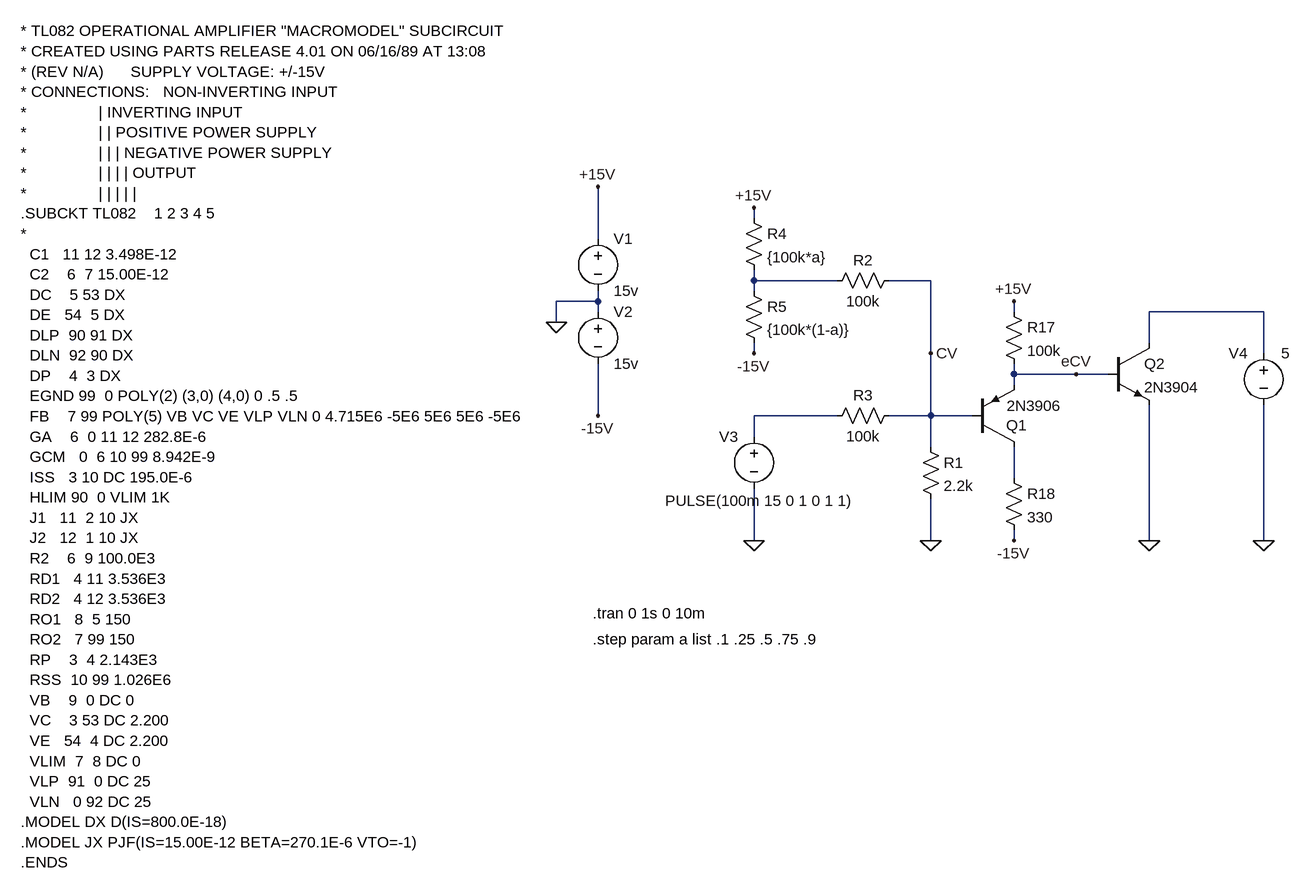
[diagram p0: schematic CV2exp2.asc]
CV2exp2.asc, the LTspice schematic file:
Version 4
SHEET 1 2688 2848
WIRE -544 32 -544 16
WIRE -784 64 -784 -16
WIRE -544 128 -544 112
WIRE -416 128 -544 128
WIRE -272 128 -336 128
WIRE -544 144 -544 128
WIRE -784 160 -784 144
WIRE -784 160 -848 160
WIRE -784 176 -784 160
WIRE -144 176 -144 160
WIRE 240 176 64 176
WIRE -848 192 -848 160
WIRE 64 224 64 176
WIRE -544 240 -544 224
WIRE -272 240 -272 128
WIRE 240 240 240 176
WIRE -144 272 -144 256
WIRE -48 272 -144 272
WIRE 0 272 -48 272
WIRE -144 288 -144 272
WIRE -784 336 -784 256
WIRE -416 336 -544 336
WIRE -272 336 -272 240
WIRE -272 336 -336 336
WIRE -208 336 -272 336
WIRE -544 368 -544 336
WIRE -272 384 -272 336
WIRE -144 432 -144 384
WIRE -544 528 -544 448
WIRE -272 528 -272 464
WIRE -144 528 -144 512
WIRE 64 528 64 320
WIRE 240 528 240 320
FLAG -848 192 0
FLAG -784 -16 +15V
FLAG -784 336 -15V
FLAG -544 528 0
FLAG 64 528 0
FLAG -272 528 0
FLAG 240 528 0
FLAG -272 240 CV
FLAG -48 272 eCV
FLAG -544 240 -15V
FLAG -144 528 -15V
FLAG -544 16 +15V
FLAG -144 160 +15V
SYMBOL voltage -784 48 R0
SYMATTR InstName V1
SYMATTR Value 15v
SYMBOL voltage -784 160 R0
SYMATTR InstName V2
SYMATTR Value 15v
SYMBOL voltage -544 352 M0
WINDOW 123 0 0 Left 0
WINDOW 39 0 0 Left 0
WINDOW 3 -154 115 Left 2
SYMATTR Value PULSE(100m 15 0 1 0 1 1)
SYMATTR InstName V3
SYMBOL pnp -208 384 M180
WINDOW 0 52 33 Left 2
WINDOW 3 53 63 Left 2
SYMATTR InstName Q1
SYMATTR Value 2N3906
SYMBOL npn 0 224 R0
SYMATTR InstName Q2
SYMATTR Value 2N3904
SYMBOL res -160 160 R0
SYMATTR InstName R17
SYMATTR Value 100k
SYMBOL res -160 416 R0
SYMATTR InstName R18
SYMATTR Value 330
SYMBOL res -288 368 R0
SYMATTR InstName R1
SYMATTR Value 2.2k
SYMBOL res -320 112 R90
WINDOW 0 0 56 VBottom 2
WINDOW 3 32 56 VTop 2
SYMATTR InstName R2
SYMATTR Value 100k
SYMBOL res -320 320 R90
WINDOW 0 0 56 VBottom 2
WINDOW 3 32 56 VTop 2
SYMATTR InstName R3
SYMATTR Value 100k
SYMBOL res -560 16 R0
SYMATTR InstName R4
SYMATTR Value {100k*a}
SYMBOL res -560 128 R0
SYMATTR InstName R5
SYMATTR Value {100k*(1-a)}
SYMBOL voltage 240 224 M0
WINDOW 123 0 0 Left 0
WINDOW 39 0 0 Left 0
WINDOW 3 -41 16 Left 2
SYMATTR Value 5
SYMATTR InstName V4
TEXT -1672 -256 Left 2 !* TL082 OPERATIONAL AMPLIFIER "MACROMODEL" SUBCIRCUIT\n* CREATED USING PARTS RELEASE 4.01 ON 06/16/89 AT 13:08\n* (REV N/A)      SUPPLY VOLTAGE: +/-15V\n* CONNECTIONS:   NON-INVERTING INPUT\n*                | INVERTING INPUT\n*                | | POSITIVE POWER SUPPLY\n*                | | | NEGATIVE POWER SUPPLY\n*                | | | | OUTPUT\n*                | | | | |\n.SUBCKT TL082    1 2 3 4 5\n*\n  C1   11 12 3.498E-12\n  C2    6  7 15.00E-12\n  DC    5 53 DX\n  DE   54  5 DX\n  DLP  90 91 DX\n  DLN  92 90 DX\n  DP    4  3 DX\n  EGND 99  0 POLY(2) (3,0) (4,0) 0 .5 .5\n  FB    7 99 POLY(5) VB VC VE VLP VLN 0 4.715E6 -5E6 5E6 5E6 -5E6\n  GA    6  0 11 12 282.8E-6\n  GCM   0  6 10 99 8.942E-9\n  ISS   3 10 DC 195.0E-6\n  HLIM 90  0 VLIM 1K\n  J1   11  2 10 JX\n  J2   12  1 10 JX\n  R2    6  9 100.0E3\n  RD1   4 11 3.536E3\n  RD2   4 12 3.536E3\n  RO1   8  5 150\n  RO2   7 99 150\n  RP    3  4 2.143E3\n  RSS  10 99 1.026E6\n  VB    9  0 DC 0\n  VC    3 53 DC 2.200\n  VE   54  4 DC 2.200\n  VLIM  7  8 DC 0\n  VLP  91  0 DC 25\n  VLN   0 92 DC 25\n.MODEL DX D(IS=800.0E-18)\n.MODEL JX PJF(IS=15.00E-12 BETA=270.1E-6 VTO=-1)\n.ENDS
TEXT -792 640 Left 2 !.tran 0 1s 0 10m
TEXT -792 680 Left 2 !.step param a list .1 .25 .5 .75 .9

The netlist it stands for:
* CV2exp2.asc
V1 +15V 0 15v
V2 0 -15V 15v
V3 N003 0 PULSE(100m 15 0 1 0 1 1)
Q1 N004 CV eCV 0 2N3906
Q2 N002 eCV 0 0 2N3904
R17 +15V eCV 100k
R18 N004 -15V 330
R1 CV 0 2.2k
R2 CV N001 100k
R3 CV N003 100k
R4 +15V N001 {100k*a}
R5 N001 -15V {100k*(1-a)}
V4 N002 0 5
.model NPN NPN
.model PNP PNP
.lib standard.bjt
* TL082 OPERATIONAL AMPLIFIER "MACROMODEL" SUBCIRCUIT
* CREATED USING PARTS RELEASE 4.01 ON 06/16/89 AT 13:08
* (REV N/A)      SUPPLY VOLTAGE: +/-15V
* CONNECTIONS:   NON-INVERTING INPUT
*                | INVERTING INPUT
*                | | POSITIVE POWER SUPPLY
*                | | | NEGATIVE POWER SUPPLY
*                | | | | OUTPUT
*                | | | | |
.SUBCKT TL082    1 2 3 4 5
*
  C1   11 12 3.498E-12
  C2    6  7 15.00E-12
  DC    5 53 DX
  DE   54  5 DX
  DLP  90 91 DX
  DLN  92 90 DX
  DP    4  3 DX
  EGND 99  0 POLY(2) (3,0) (4,0) 0 .5 .5
  FB    7 99 POLY(5) VB VC VE VLP VLN 0 4.715E6 -5E6 5E6 5E6 -5E6
  GA    6  0 11 12 282.8E-6
  GCM   0  6 10 99 8.942E-9
  ISS   3 10 DC 195.0E-6
  HLIM 90  0 VLIM 1K
  J1   11  2 10 JX
  J2   12  1 10 JX
  R2    6  9 100.0E3
  RD1   4 11 3.536E3
  RD2   4 12 3.536E3
  RO1   8  5 150
  RO2   7 99 150
  RP    3  4 2.143E3
  RSS  10 99 1.026E6
  VB    9  0 DC 0
  VC    3 53 DC 2.200
  VE   54  4 DC 2.200
  VLIM  7  8 DC 0
  VLP  91  0 DC 25
  VLN   0 92 DC 25
.MODEL DX D(IS=800.0E-18)
.MODEL JX PJF(IS=15.00E-12 BETA=270.1E-6 VTO=-1)
.ENDS
.tran 0 1s 0 10m
.step param a list .1 .25 .5 .75 .9
.backanno
.end